# EAGLE design AudioBoard (EAGLE 9.5.2)
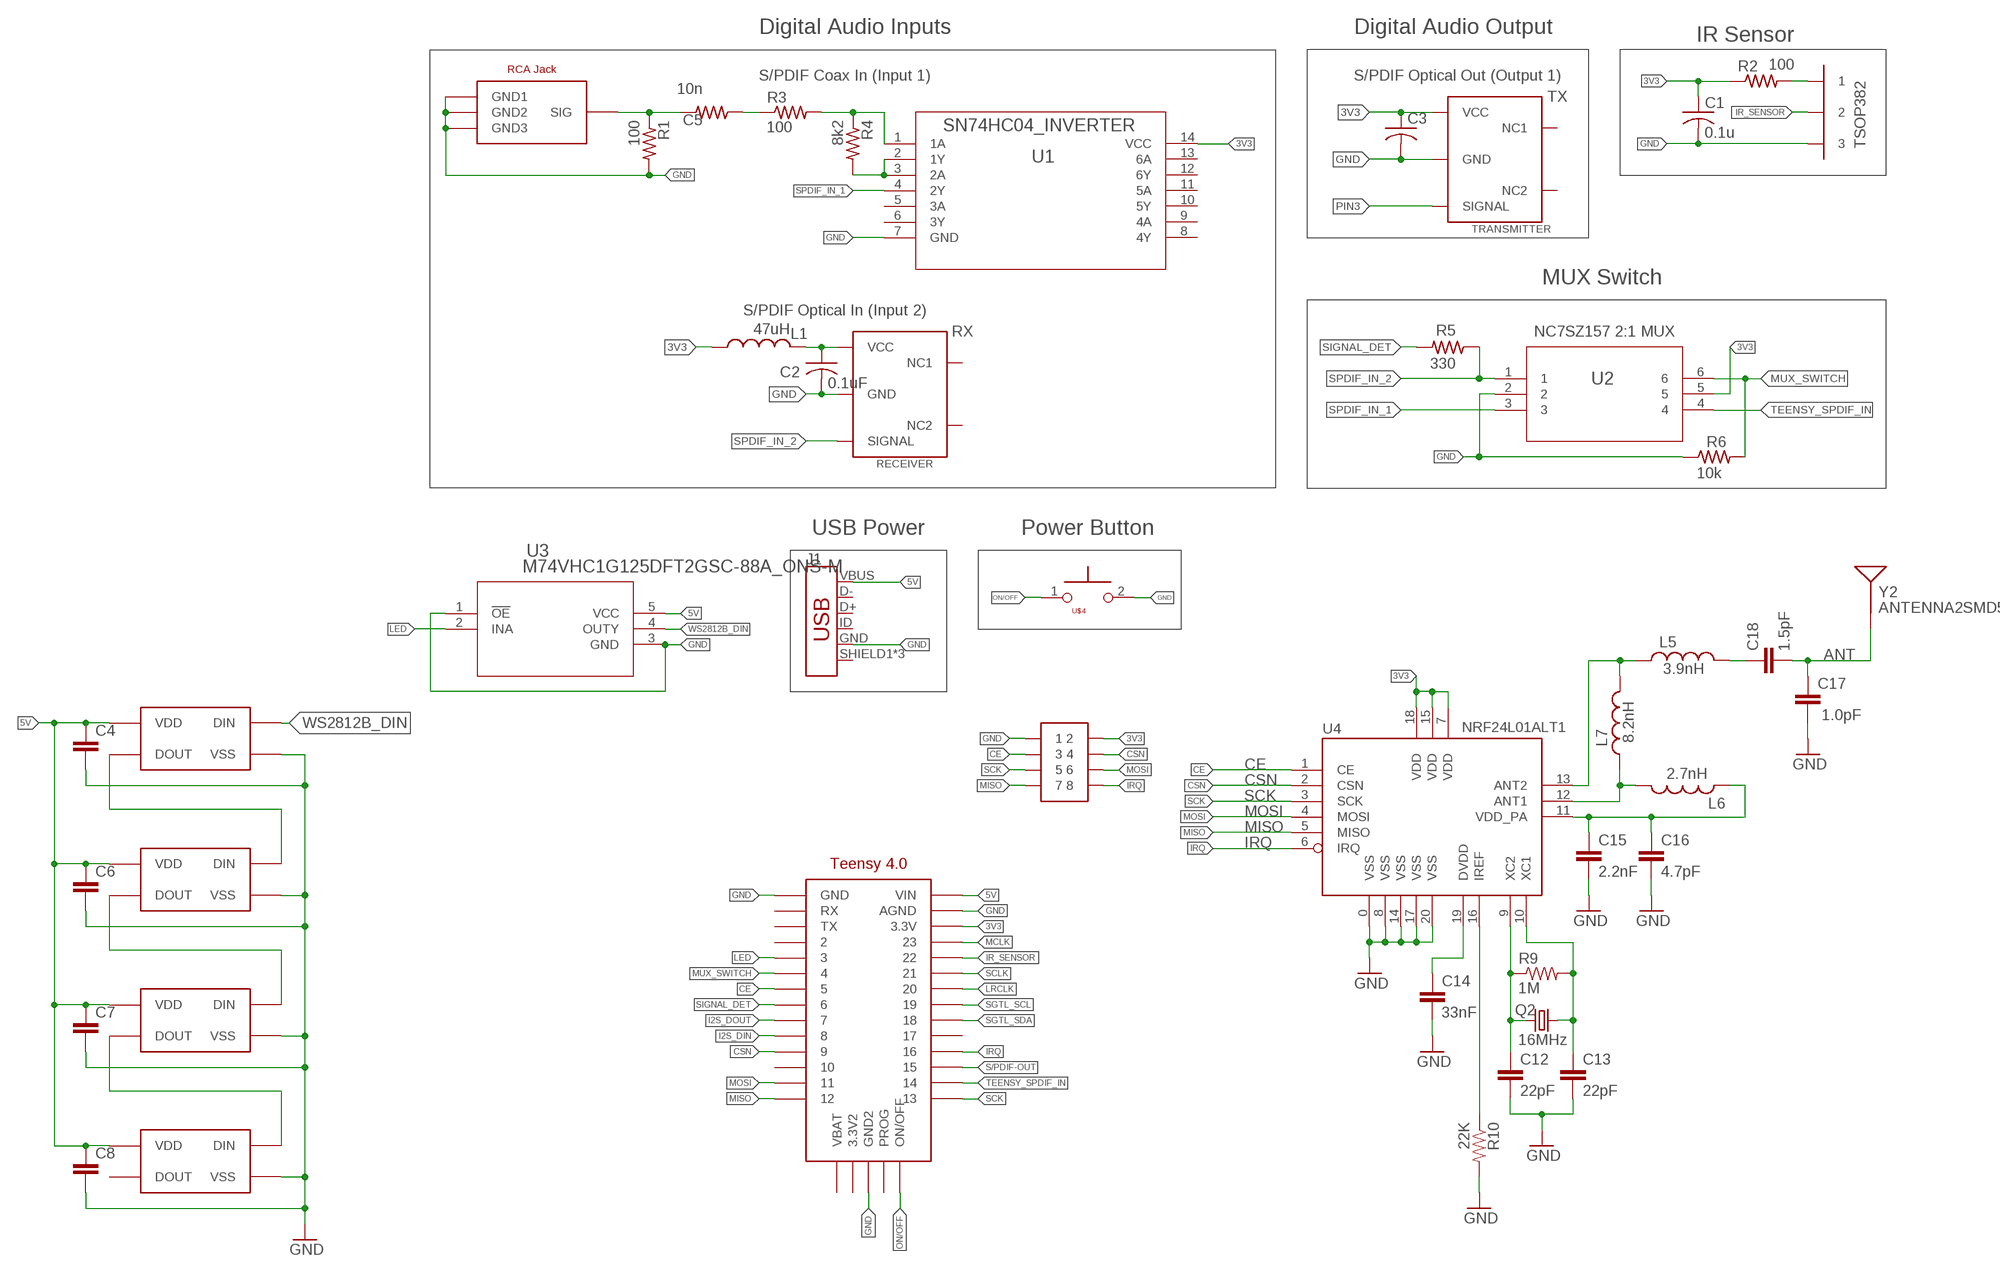
[diagram p0: schematic, sheet 1]

## Parts
C1  0.1u  C-USC0603K  [C0603K]
C2  0.1uF  C-USC0603  [C0603]
C3  C-USC0603  [C0603]
C4  C-EUC0603  [C0603]
C5  10n  R-US_R0603  [R0603]
C6  C-EUC0603  [C0603]
C7  C-EUC0603  [C0603]
C8  C-EUC0603  [C0603]
C12  22pF  CAP0402-CAP  [0402-CAP]
C13  22pF  CAP0402-CAP  [0402-CAP]
C14  33nF  CAP0402-CAP  [0402-CAP]
C15  2.2nF  CAP0402-CAP  [0402-CAP]
C16  4.7pF  CAP0402-CAP  [0402-CAP]
C17  1.0pF  CAP0402-CAP  [0402-CAP]
C18  1.5pF  CAP0402-CAP  [0402-CAP]
J1  USB_MICRO-BREDUCED_PASTE  [USB-B-MICRO-SMD_RED_PASTE]
L1  47uH  L-USL2012C  [L2012C]
L5  3.9nH  INDUCTOR0402  [C0402]
L6  2.7nH  INDUCTOR0402  [C0402]
L7  8.2nH  INDUCTOR0402  [C0402]
Q2  16MHz  CRYSTAL5X3  [CRYSTAL-SMD-5X3]
R1  100  R-US_R0603  [R0603]
R2  100  R-US_R0603  [R0603]
R3  100  R-US_R0603  [R0603]
R4  8k2  R-US_R0603  [R0603]
R5  330  R-US_R0603  [R0603]
R6  10k  R-US_R0603  [R0603]
R9  1M  RESISTOR0402-RES  [0402-RES]
R10  22K  RESISTOR0402-RES  [0402-RES]
RECEIVER  S/PDIF-IN  [SPDIF-IN]
TRANSMITTER  S/PDIF-OUT  [SPDIF-OUT]
U1  SN74HC04_INVERTER  [NS14]
U2  2:1_MUX_NC7SZ157P6X  [SOIC_Z157P6X_ONS]
U3  M74VHC1G125DFT2GSC-88A_ONS-M  [SC-88A_ONS-M]
U4  NRF24L01ALT1  [QFN20_ALT1]
U$1  1X3HEADER  [1X3HEADER]
U$2  RCA_JACK  [RCA_JACK]
U$3  TEENSY4.0  [TEENSY4.0]
U$4  SMD_BUTTON  [SMD]
U$5  WS2812B  [WS2812B]
U$6  WS2812B  [WS2812B]
U$7  WS2812B  [WS2812B]
U$8  WS2812B  [WS2812B]
U$9  2X4HEADER  [2X4HEADER]
Y2  ANTENNA2SMD5  [ANTENNA-CHIP5]

## Nets
1TO2: U$5.DOUT U$6.DIN
2TO3: U$6.DOUT U$7.DIN
3TO4: U$7.DOUT U$8.DIN
3V3 [5v]: C1.1 C3.1 L1.1 R2.1 TRANSMITTER.VCC U1.14(VCC) U2.5 U4.7(VDD) U4.15(VDD) U4.18(VDD) U$3.3.3V U$9.2
5V [5v]: C4.1 C6.1 C7.1 C8.1 J1.VBUS U3.5(VCC) U$3.VIN U$5.VDD U$6.VDD U$7.VDD U$8.VDD
ANT: C17.2 C18.2 Y2.FEED(SIGNAL)
CE: U4.1(CE) U$3.5 U$9.3
CSN: U4.2(CSN) U$3.9 U$9.4
GND: C1.2 C2.2 C3.2 C4.2 C6.2 C7.2 C8.2 C12.2 C13.2 C14.2 C15.2 C16.2 C17.1 J1.GND R1.2 R6.1 R10.2 RECEIVER.GND TRANSMITTER.GND U1.7(GND) U2.2 U3.1(!OE) U3.3(GND) U4.0(VSS) U4.8(VSS) U4.14(VSS) U4.17(VSS) U4.20(VSS) U$1.P$3 U$2.GND1 U$2.GND2 U$2.GND3 U$3.AGND U$3.GND U$3.GND2 U$4.2 U$5.VSS U$6.VSS U$7.VSS U$8.VSS U$9.1
I2S_DIN: U$3.8
I2S_DOUT: U$3.7
IR_SENSOR: U$1.P$2 U$3.22
IRQ: U4.6(IRQ) U$3.16 U$9.8
LED: U3.2(INA) U$3.3
LRCLK: U$3.20
MCLK: U$3.23
MISO: U4.5(MISO) U$3.12 U$9.7
MOSI: U4.4(MOSI) U$3.11 U$9.6
MUX_SWITCH: R6.2 U2.6 U$3.4
N$1: C5.2 R1.1 U$2.SIG
N$2: R2.2 U$1.P$1
N$3: C5.1 R3.1
N$4: R3.2 R4.1 U1.1(1A)
N$5: C2.1 L1.2 RECEIVER.VCC
N$6: R4.2 U1.2(1Y) U1.3(2A)
N$15: C12.1 Q2.1 R9.1 U4.9(XC2)
N$16: C13.1 Q2.3 R9.2 U4.10(XC1)
N$17: L5.1 L7.2 U4.13(ANT2)
N$18: C15.1 C16.1 L6.1 U4.11(VDD_PA)
N$19: R10.1 U4.16(IREF)
N$20: C14.1 U4.19(DVDD)
N$21: L6.2 L7.1 U4.12(ANT1)
N$22: C18.1 L5.2
ON/OFF: U$3.ON/OFF U$4.1
PIN3: TRANSMITTER.SIGNAL
S/PDIF-OUT: U$3.15
SCK: U4.3(SCK) U$3.13 U$9.5
SCLK: U$3.21
SGTL_SCL: U$3.19
SGTL_SDA: U$3.18
SIGNAL_DET: R5.2 U$3.6
SPDIF_IN_1: U1.4(2Y) U2.3
SPDIF_IN_2: R5.1 RECEIVER.SIGNAL U2.1
TEENSY_SPDIF_IN: U2.4 U$3.14
WS2812B_DIN: U3.4(OUTY) U$5.DIN
Unconnected: J1.D+ J1.D- J1.ID J1.SHIELD1(SHIELD) J1.SHIELD2(SHIELD) J1.SHIELD3(SHIELD) RECEIVER.NC1 RECEIVER.NC2 TRANSMITTER.NC1 TRANSMITTER.NC2 U1.5(3A) U1.6(3Y) U1.8(4Y) U1.9(4A) U1.10(5Y) U1.11(5A) U1.12(6Y) U1.13(6A) U$3.2 U$3.3.3V2 U$3.10 U$3.17 U$3.PROG U$3.RX U$3.TX U$3.VBAT U$8.DOUT

## Notes on the sheet
- Digital Audio Inputs | Digital Audio Output | IR Sensor
- S/PDIF Coax In (Input 1) | S/PDIF Optical Out (Output 1) | TSOP382
- TX
- MUX Switch
- S/PDIF Optical In (Input 2)
- RX | NC7SZ157 2:1 MUX
- USB Power | Power Button

## Library data of the parts
C1-C3 = rcl:C-US: CAPACITOR, American symbol; SPICEPREFIX: C
C4 C6-C8 = resistor:C-EU: CAPACITOR, European symbol
C5 R1-R4 = resistor:R-US_: RESISTOR, American symbol
C12-C18 = SparkFun:CAP: Capacitor Standard 0603 ceramic capacitor, and 0.1" leaded capacitor.
J1 = SparkFun-Connectors:USB_MICRO-B: USB Type Micro-B Connector Male/female and PTH/SMT variants SparkFun Products: SparkFun microB USB Breakout <https://www.sparkfun.com/products/12035> SparkFun USB microB Plug Breakout <https://www.sparkfun.com/products/10031> SparkFun ESP8266 Thing <https://www.sparkfun.com/products/13231>; PROD_ID: CONN-11752
L1 = resistor:L-US: INDUCTOR, American symbol
L5-L7 = SparkFun:INDUCTOR: Inductors Basic Inductor/Choke - 0603 and 1206. Footprints are not proven and vary greatly between part numbers.
Q2 = SparkFun:CRYSTAL: Crystals Various standard crystals. Proven footprints. Spark Fun Electronics SKU : COM-00534
R5 R6 = rcl:R-US_: RESISTOR, American symbol; SPICEPREFIX: R
R9 R10 = SparkFun:RESISTOR: Resistor Basic schematic elements and footprints for 0603, 1206, and PTH resistors.
RECEIVER = SPDIF:S/PDIF-IN
TRANSMITTER = SPDIF:S/PDIF-OUT
U1 = COAX_SPDIF:SN74HC04_INVERTER; DATASHEET_URL: http://www.ti.com/lit/gpn/SN74HC04; DESCRIPTION: Hex Inverters; FAMILY_NAME: INVERTING BUFFER/DRIVER; GENERIC_PART_NUMBER: SN74HC04; INDUSTRY_STD_PKG_TYPE: SO; MANUFACTURER: Texas Instruments; PACKAGE_DESIGNATOR: NS; PIN_COUNT: 14
U2 = AudioSwitch:2:1_MUX_NC7SZ157P6X; DATASHEET: https://datasheet.octopart.com/NC7SZ157P6X-ON-Semiconductor-datasheet-137360983.pdf; MANUFACTURER_PART_NUMBER: NC7SZ157P6X; SOURCELIBRARY: ON_Semiconductor_2020-03-06; VENDOR: ON Semiconductor
U3 = AudioSwitch:M74VHC1G125DFT2G; COPYRIGHT: Copyright (C) 2016 Accelerated Designs. All rights reserved; MANUFACTURER_PART_NUMBER: M74VHC1G125DFT2G; SOURCELIBRARY: ONSemi_2017-12-12_1; VENDOR: ON Semiconductor
U4 = Testing:NRF24L01: 2.4GHz Low Power Transceiver This is the very popular, low cost, very low power RF transceiver from Nordic Semiconductor. Simple SPI interface. SKU: COM-00690
U$1 = 1x2HEADER:1X3HEADER
U$2 = COAX_SPDIF:RCA_JACK
U$3 = Teensy3.2:TEENSY4.0
U$4 = smd_button:SMD_BUTTON
U$5-U$8 = Neopixel WS2812B:WS2812B
U$9 = 1x2HEADER:2X4HEADER
Y2 = SparkFun:ANTENNA2: Antenna Single endded antenna. Common with smaller chip antennas. CHIP4 package is the GPS Chip Antenna SKU: GPS-08418. CHIP5 package is 2.4GHz chip antenna SKU: WRL-00144.

## Net classes
1 5v: width 0.381 mm

## Board
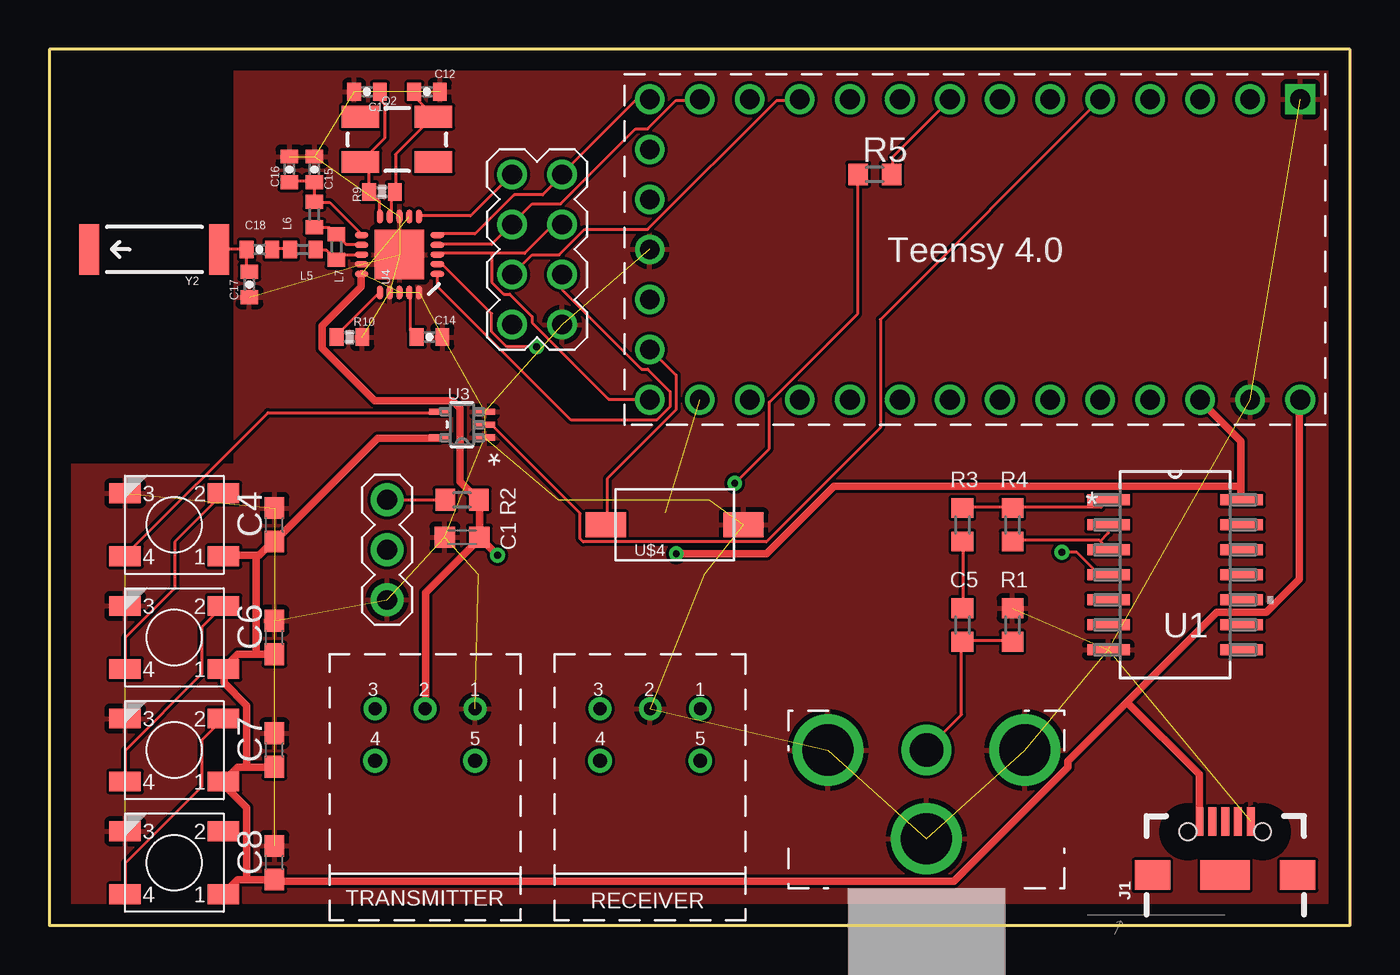
[diagram p1: board, top side]
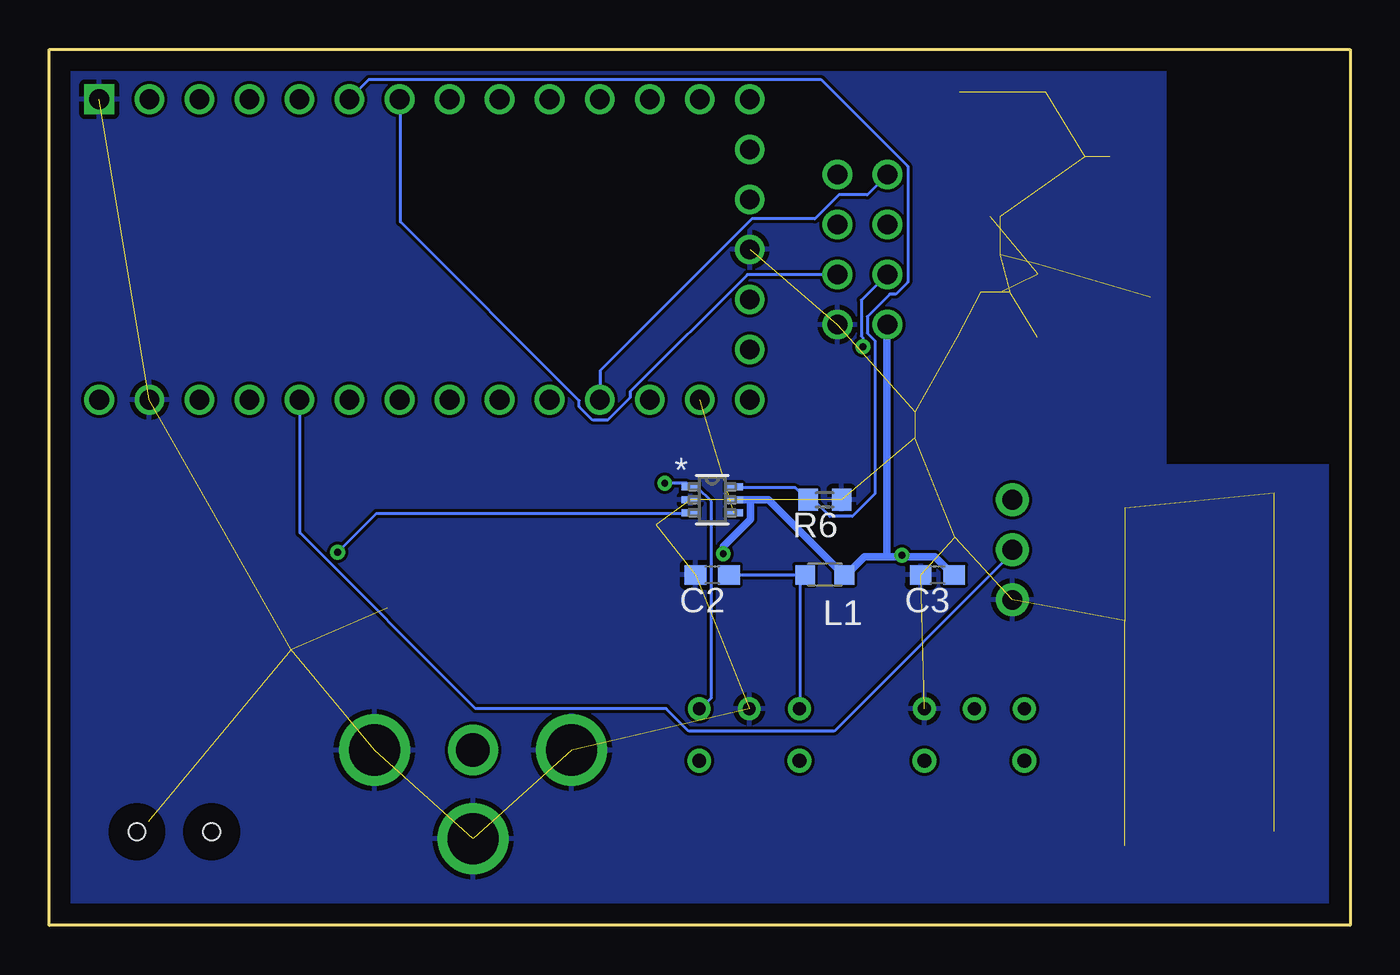
[diagram p2: board, bottom side, seen from below]

Size 66.04 x 44.45 mm. Coordinates in mm from the lower left corner, seen from the top.
Outline: 0,0 66.04,0 66.04,44.45 0,44.45 0,0
Copper layers (1*16): Top 0.035mm / dielectric 1.5mm / Bottom 0.035mm
Design rules "default *": minimum track width 6mil, minimum drill 0.35mm, track to track 6mil, track to pad 6mil, pad to pad 6mil, via to via 6mil, smd to smd 6mil, copper to edge 40mil, drill to drill 6mil, minimum pad ring 10mil, minimum via ring 8mil, stop-mask expansion 4mil, vias tented up to drill 20mil, thermal gap 10mil
tKeepout: area -0.6,24.1 to 8.9,44.4
bKeepout: area -0.6,24.1 to 8.9,44.4

### Footprints (pad centres in the part's own frame; a part is rotated, then mirrored left to right if it is on the bottom)
C0603K = smd 1.05 x 1.08: 1 -0.875,0; 2 0.875,0
C0603 = smd 1.1 x 1: 1 -0.85,0; 2 0.85,0
R0603 = smd 1 x 1.1: 1 -0.85,0; 2 0.85,0
0402-CAP = smd 0.7 x 0.9: 1 -0.65,0; 2 0.65,0
USB-B-MICRO-SMD_RED_PASTE = smd 1.45 x 0.4: D+ 2.725,0; D- 2.725,0.65; GND 2.725,-1.3; ID 2.725,-0.65; VBUS 2.725,1.3 | smd 1.5 x 1.8: SHIELD1 0,3.685; SHIELD2 0,-3.685 | smd 1.5 x 2.5: SHIELD3 0,0 | hole 0.85: 2.2,1.9; 2.2,-1.9
L2012C = smd 1 x 1: 1 -1,0; 2 1,0
C0402 = smd 0.7 x 0.9: 1 -0.65,0; 2 0.65,0
CRYSTAL-SMD-5X3 = smd 1.9 x 1.1: 1 -1.85,-1.15; 2 1.85,-1.15; 3 1.85,1.15; 4 -1.85,1.15
0402-RES = smd 0.7 x 0.9: 1 -0.65,0; 2 0.65,0
SPDIF-IN = drill 0.65: GND 5.056,2.991; SIGNAL 2.516,2.991; VCC 7.596,2.991 | drill 0.7: NC1 2.516,5.616; NC2 7.596,5.616
SPDIF-OUT = drill 0.65: GND 2.516,2.991; SIGNAL 7.596,2.991; VCC 5.056,2.991 | drill 0.7: NC1 2.516,5.616; NC2 7.596,5.616
NS14 = smd 2.159 x 0.559: 1 -3.378,3.81; 2 -3.378,2.54; 3 -3.378,1.27; 4 -3.378,0; 5 -3.378,-1.27; 6 -3.378,-2.54; 7 -3.378,-3.81; 8 3.378,-3.81; 9 3.378,-2.54; 10 3.378,-1.27; 11 3.378,0; 12 3.378,1.27; 13 3.378,2.54; 14 3.378,3.81
SOIC_Z157P6X_ONS = smd 0.876 x 0.356: 1 -1.111,0.65; 2 -1.111,0; 3 -1.111,-0.65; 4 1.111,-0.65; 5 1.111,0; 6 1.111,0.65
SC-88A_ONS-M = smd 1.041 x 0.305: 1 -1.143,0.65; 2 -1.143,0; 3 -1.143,-0.65; 4 1.143,-0.65; 5 1.143,0.65
QFN20_ALT1 = smd 2.515 x 2.515: 0 0,0 | smd 0.686 x 0.293: 1 -1.925,0.986; 2 -1.925,0.493; 3 -1.925,0; 4 -1.925,-0.493; 5 -1.925,-0.986; 11 1.925,-0.986; 12 1.925,-0.493; 13 1.925,0; 14 1.925,0.493; 15 1.925,0.986 | smd 0.293 x 0.686: 6 -0.986,-1.925; 7 -0.493,-1.925; 8 0,-1.925; 9 0.493,-1.925; 10 0.986,-1.925; 16 0.986,1.925; 17 0.493,1.925; 18 0,1.925; 19 -0.493,1.925; 20 -0.986,1.925
1X3HEADER = drill 1 pad 1.676: P$1 1.27,1.27; P$2 3.81,1.27; P$3 6.35,1.27
RCA_JACK = drill 2.6: GND1 0,0; GND2 5,4.5; GND3 10,0 | drill 1.7: SIG 5,0
TEENSY4.0 = drill 1: 2 1.27,26.67; 3 1.27,24.13; 3.3V 16.51,29.21; 3.3V2 6.35,1.27; 4 1.27,21.59; 5 1.27,19.05; 6 1.27,16.51; 7 1.27,13.97; 8 1.27,11.43; 9 1.27,8.89; 10 1.27,6.35; 11 1.27,3.81; 12 1.27,1.27; 13 16.51,1.27; 14 16.51,3.81; 15 16.51,6.35; 16 16.51,8.89; 17 16.51,11.43; 18 16.51,13.97; 19 16.51,16.51; 20 16.51,19.05; 21 16.51,21.59; 22 16.51,24.13; 23 16.51,26.67; AGND 16.51,31.75; GND2 8.89,1.27; ON/OFF 13.97,1.27; PROG 11.43,1.27; RX 1.27,31.75; TX 1.27,29.21; VBAT 3.81,1.27; VIN 16.51,34.29 | drill 1 square: GND 1.27,34.29
SMD = smd 2.032 x 1.27: 1 3.5,0; 2 -3.5,0
WS2812B = smd 1.6 x 1: DIN 2.5,1.6; DOUT -2.5,-1.6; VDD -2.5,1.6; VSS 2.5,-1.6
2X4HEADER = drill 1: 1 1.27,8.89; 2 3.81,8.89; 3 1.27,6.35; 4 3.81,6.35; 5 1.27,3.81; 6 3.81,3.81; 7 1.27,1.27; 8 3.81,1.27
ANTENNA-CHIP5 = smd 1.016 x 2.54: FEED -3.302,0; NC 3.302,0

### Placement (x,y rotation side)
C1  20.95,19.68 180 top
C2  32.38,17.78 180 bottom
C3  20.95,17.78 180 bottom
C4  11.43,20.32 90 top
C5  46.36,15.24 270 top
C6  11.43,14.6 90 top
C7  11.43,8.89 90 top
C8  11.43,3.17 90 top
C12  19.18,42.29 0 top
C13  16.13,42.29 180 top
C14  19.3,29.84 0 top
C15  13.46,38.35 90 top
C16  12.19,38.35 90 top
C17  10.16,32.51 90 top
C18  10.67,34.29 180 top
J1  59.69,2.54 90 top
L1  26.67,17.78 180 bottom
L5  12.88,34.29 180 top
L6  13.46,36.07 270 top
L7  14.58,34.42 270 top
Q2  17.65,39.88 180 top
R1  48.89,15.24 90 top
R2  20.95,21.59 180 top
R3  46.36,20.32 90 top
R4  48.89,20.32 270 top
R5  41.91,38.1 0 top
R6  26.67,21.59 180 bottom
R9  16.89,37.21 180 top
R10  15.24,29.84 0 top
RECEIVER  35.56,13.97 180 top
TRANSMITTER  24.13,13.97 180 top
U1  57.15,17.78 0 top
U2  32.38,21.59 0 bottom
U3  20.95,25.4 180 top
U4  17.78,34.04 180 top
U$1  15.87,22.86 270 top
U$2  49.53,8.89 180 top
U$3  29.21,43.18 270 top
U$4  31.75,20.32 180 top
U$5  6.35,20.32 180 top
U$6  6.35,14.6 180 top
U$7  6.35,8.89 180 top
U$8  6.35,3.17 180 top
U$9  27.3,39.37 180 top
Y2  5.33,34.29 180 top

### Tracks (layer width: path | path; a pad name or v marks a point on that pad's centre or on a via)
1TO2
  Top 0.152: U$6.DIN 3.86,13.06 3.86,14.58 6.38,17.09 6.38,19.46 8.81,21.89 U$5.DOUT
2TO3
  Top 0.152: U$7.DIN 3.86,7.34 3.86,8.86 7.75,12.75 7.75,15.11 8.81,16.18 U$6.DOUT
3TO4
  Top 0.152: U$8.DIN 3.86,1.63 3.86,3.15 7.75,7.04 7.75,9.4 8.81,10.46 U$7.DOUT
3V3  (via drill 0.35)  (2 unrouted)
  Top 0.381: U4.15 15.82,33.02 15.82,32.41 13.84,30.43 13.84,29.29 16.51,26.62 20.47,26.62 20.85,26.24 20.85,22.5 21.77,21.59 R2.1 21.84,21.44 21.84,19.68 C1.1 | TRANSMITTER.VCC 19.1,11 19.1,16.87 21.77,19.53 C1.1 | 60.48,22.28 60.48,24.56 58.42,26.62 U$3.3.3V | 60.48,22.28 60.48,21.59 U1.14 | 60.48,22.28 39.83,22.28 36.4,18.85 v31.83,18.85 | v22.76,18.77 22.07,19.46 21.92,19.46 C1.1
  Bottom 0.381: 30.45,21.59 29.54,21.59 25.73,17.78 L1.1 25.5,17.86 24.66,18.69 23.52,18.69 | 30.45,21.59 U2.5 | 23.52,18.69 22.76,18.69 | 22.76,18.69 21.08,18.69 20.17,17.78 C3.1 | 23.52,18.69 23.52,30.43 U$9.2 | v31.83,18.85 31.83,19.23 30.45,20.6 30.45,21.59 | v22.76,18.77 22.76,18.69
5V
  Top 0.381: 10.49,13.74 9.58,13.74 8.89,13.06 U$6.VDD 8.89,12.83 8.89,12.29 10.03,11.15 10.03,8.03 | 10.49,13.74 11.4,13.74 C6.1 | U3.5 19.79,24.71 16.66,24.71 11.48,19.53 C4.1 11.25,19.38 10.64,18.77 10.49,18.77 | 10.49,18.77 8.89,18.77 U$5.VDD | 10.49,18.77 10.49,13.74 | 10.03,2.31 9.58,2.31 8.89,1.63 U$8.VDD | 10.03,2.31 11.4,2.31 C8.1 11.56,2.23 45.92,2.23 51.71,8.03 51.71,8.33 54.71,11.33 | 10.03,8.03 9.58,8.03 8.89,7.34 U$7.VDD 8.89,7.11 10.03,5.97 10.03,2.31 | 10.03,8.03 11.4,8.03 C7.1 | 54.71,11.33 59.26,15.87 61.77,15.87 63.45,17.55 63.45,26.62 U$3.VIN | J1.VBUS 58.39,7.65 54.71,11.33
ANT
  Top 0.152: C17.2 10.11,33.17 10.03,33.25 10.03,34.24 C18.2 9.96,34.31 8.66,34.31 Y2.FEED
CE
  Top 0.152: U$9.3 26.04,32.26 30.07,28.22 30.38,28.22 31.52,27.08 31.52,26.31 30.84,25.63 26.49,25.63 19.71,32.41 19.71,33.02 U4.1
  Bottom 0.152: U$9.3 30.61,33.02 36.55,27.08 36.55,26.77 37.69,25.63 38.46,25.63 39.14,26.31 39.14,26.62 48.21,35.69 48.21,41.86 U$3.5
CSN  (via drill 0.35)
  Top 0.152: v24.74,29.36 23.22,29.36 22.45,30.12 22.45,31.04 20.02,33.48 19.71,33.48 U4.2 | U$3.9 38.08,41.86 36.93,41.86 30.38,35.31 27.18,35.31 25.88,34.01 24.51,34.01 23.52,33.02 U$9.4
  Bottom 0.152: v24.74,29.36 24.74,29.82 24.82,29.9 24.82,31.72 23.52,33.02 U$9.4
GND  (40 unrouted)
  pour Top: 19.05,46.99 9.4,46.99 9.4,23.37 -4.83,23.37 -4.83,-4.19 72.64,-4.19 72.64,44.32 72.64,46.99
  pour Bottom: 16.51,49.53 9.4,49.53 9.4,23.37 -1.14,23.37 -1.14,22.35 -1.14,-8.89 76.2,-8.89 76.2,49.53
IR_SENSOR
  Bottom 0.152: U$3.22 53.31,26.62 53.31,19.91 44.4,11 34.72,11 33.58,9.85 26.19,9.85 17.2,18.85 17.2,19 U$1.P$2
IRQ
  Top 0.152: U$9.8 21.39,35.99 18.8,35.99 U4.6
  Bottom 0.152: U$3.16 38.08,26.69 38.08,28.14 30.38,35.84 27.18,35.84 25.96,37.06 24.51,37.06 23.52,38.05 U$9.8
LED
  Top 0.152: U3.2 22.45,25.4 26.95,20.9 26.95,19.61 27.1,19.46 36.4,19.46 42.19,25.25 42.19,30.73 53.31,41.86 U$3.3
MISO
  Top 0.152: U4.5 19.71,35.08 21.61,35.08 23.6,37.06 25.04,37.06 26.04,38.05 U$9.7 26.04,38.12 29.77,41.86 30.45,41.86 U$3.12
MOSI
  Top 0.152: U4.4 19.71,34.54 22.45,34.54 23.44,35.53 U$9.6 23.52,35.61 24.51,36.6 25.96,36.6 29.77,40.41 30.38,40.41 31.83,41.86 32.97,41.86 U$3.11
MUX_SWITCH
  Bottom 0.152: U2.6 31.22,22.2 28.17,22.2 27.56,21.59 R6.2 27.25,21.59 26.42,20.75 25.27,20.75 24.13,21.89 24.13,29.67 24.51,30.05 24.51,30.89 23.37,32.03 23.06,32.03 22.45,32.64 22.45,38.51 26.87,42.93 49.81,42.93 50.8,41.94 U$3.4
N$1
  Top 0.152: R1.1 48.89,14.43 46.38,14.43 C5.2 46.3,14.35 46.3,10.69 44.55,8.94 U$2.SIG
N$2
  Top 0.152: U$1.P$1 R2.2
N$3
  Top 0.152: C5.1 46.38,16.1 46.38,19.46 R3.1
N$4
  Top 0.152: 48.89,21.21 46.38,21.21 R3.2 | 48.89,21.21 53.39,21.21 U1.1 | 48.89,21.21 R4.1
N$5
  Bottom 0.152: C2.1 27.94,17.78 | 27.94,17.78 L1.2 27.71,17.78 | 27.94,17.78 27.94,11 RECEIVER.VCC
N$6
  Top 0.152: 53.35,19.5 53.77,19.07 U1.3 | 53.35,19.5 53.31,19.53 48.89,19.53 R4.2 | U1.2 53.77,19.91 53.35,19.5
N$15
  Top 0.152: U4.9 17.35,35.99 17.35,37.06 17.5,37.21 R9.1 17.58,37.21 17.58,39.12 19.48,41.02 Q2.1 19.48,41.1 18.57,42.01 18.57,42.24 C12.1
N$16
  Top 0.152: U4.10 16.74,35.99 16.74,36.75 16.28,37.21 R9.2 16.2,37.21 16.2,38.28 15.82,38.66 Q2.3 15.82,38.73 17.04,39.95 17.04,41.63 16.81,41.86 16.81,42.24 C13.1
N$17
  Top 0.152: U4.13 15.82,34.01 14.83,34.01 14.6,33.78 L7.2 14.53,33.78 14.07,34.24 13.54,34.24 L5.1
N$18
  Top 0.152: C16.1 12.24,37.74 13.39,37.74 C15.1 13.46,37.67 L6.1 13.46,36.68 14.22,36.68 15.82,35.08 U4.11
N$19
  Top 0.152: U4.16 16.74,32.11 14.53,29.9 R10.1
N$20
  Top 0.152: U4.19 18.34,32.11 18.34,30.2 18.64,29.9 C14.1
N$21
  Top 0.152: U4.12 15.82,34.54 15.06,34.54 14.6,35 L7.1 14.53,35.08 14.22,35.38 13.46,35.38 L6.2
N$22
  Top 0.152: C18.1 11.33,34.31 12.17,34.31 L5.2
ON/OFF
  Top 0.152: U$4.1 28.32,20.37 28.32,22.66 31.83,26.16 31.83,27.91 30.53,29.21 U$3.ON/OFF
SCK
  Top 0.152: 22.45,34.09 24.13,34.09 25.58,35.53 26.04,35.53 U$9.5 | 22.45,34.09 19.71,34.09 U4.3 | 22.45,34.09 22.45,32.64 23.06,32.03 23.37,32.03 24.51,30.89 24.51,30.58 28.4,26.69 30.45,26.69 U$3.13
SIGNAL_DET
  Top 0.152: R5.2 42.8,38.12 42.8,38.96 45.7,41.86 U$3.6
SPDIF_IN_1  (via drill 0.35)
  Top 0.152: v51.41,18.92 52.17,18.92 53.31,17.78 U1.4
  Bottom 0.152: v51.41,18.92 49.43,20.9 33.5,20.9 U2.3
SPDIF_IN_2  (via drill 0.35)
  Top 0.152: v34.8,22.43 36.55,24.18 36.55,26.54 41.05,31.04 41.05,38.05 R5.1
  Bottom 0.152: RECEIVER.SIGNAL 32.97,11 32.44,11.53 32.44,21.51 33.12,22.2 33.43,22.2 U2.1 33.5,22.28 33.66,22.43 v34.8,22.43
TEENSY_SPDIF_IN  (1 unrouted)
WS2812B_DIN
  Top 0.152: U3.4 19.79,26.01 11.1,26.01 3.86,18.77 U$5.DIN